# Altium schematic sheet WL-FRONT.SchDoc
size 420 x 297 mm; Address1: Address1; Address2: Address2; Address3: Address3; Address4: Address4; DocumentNumber: АБВГ.123456.001 Э3; SheetNumber: 1; Scale: 1:1; DocumentType: Схема электрическая принципиальная; FirstReferrence: АБВГ.123456.001
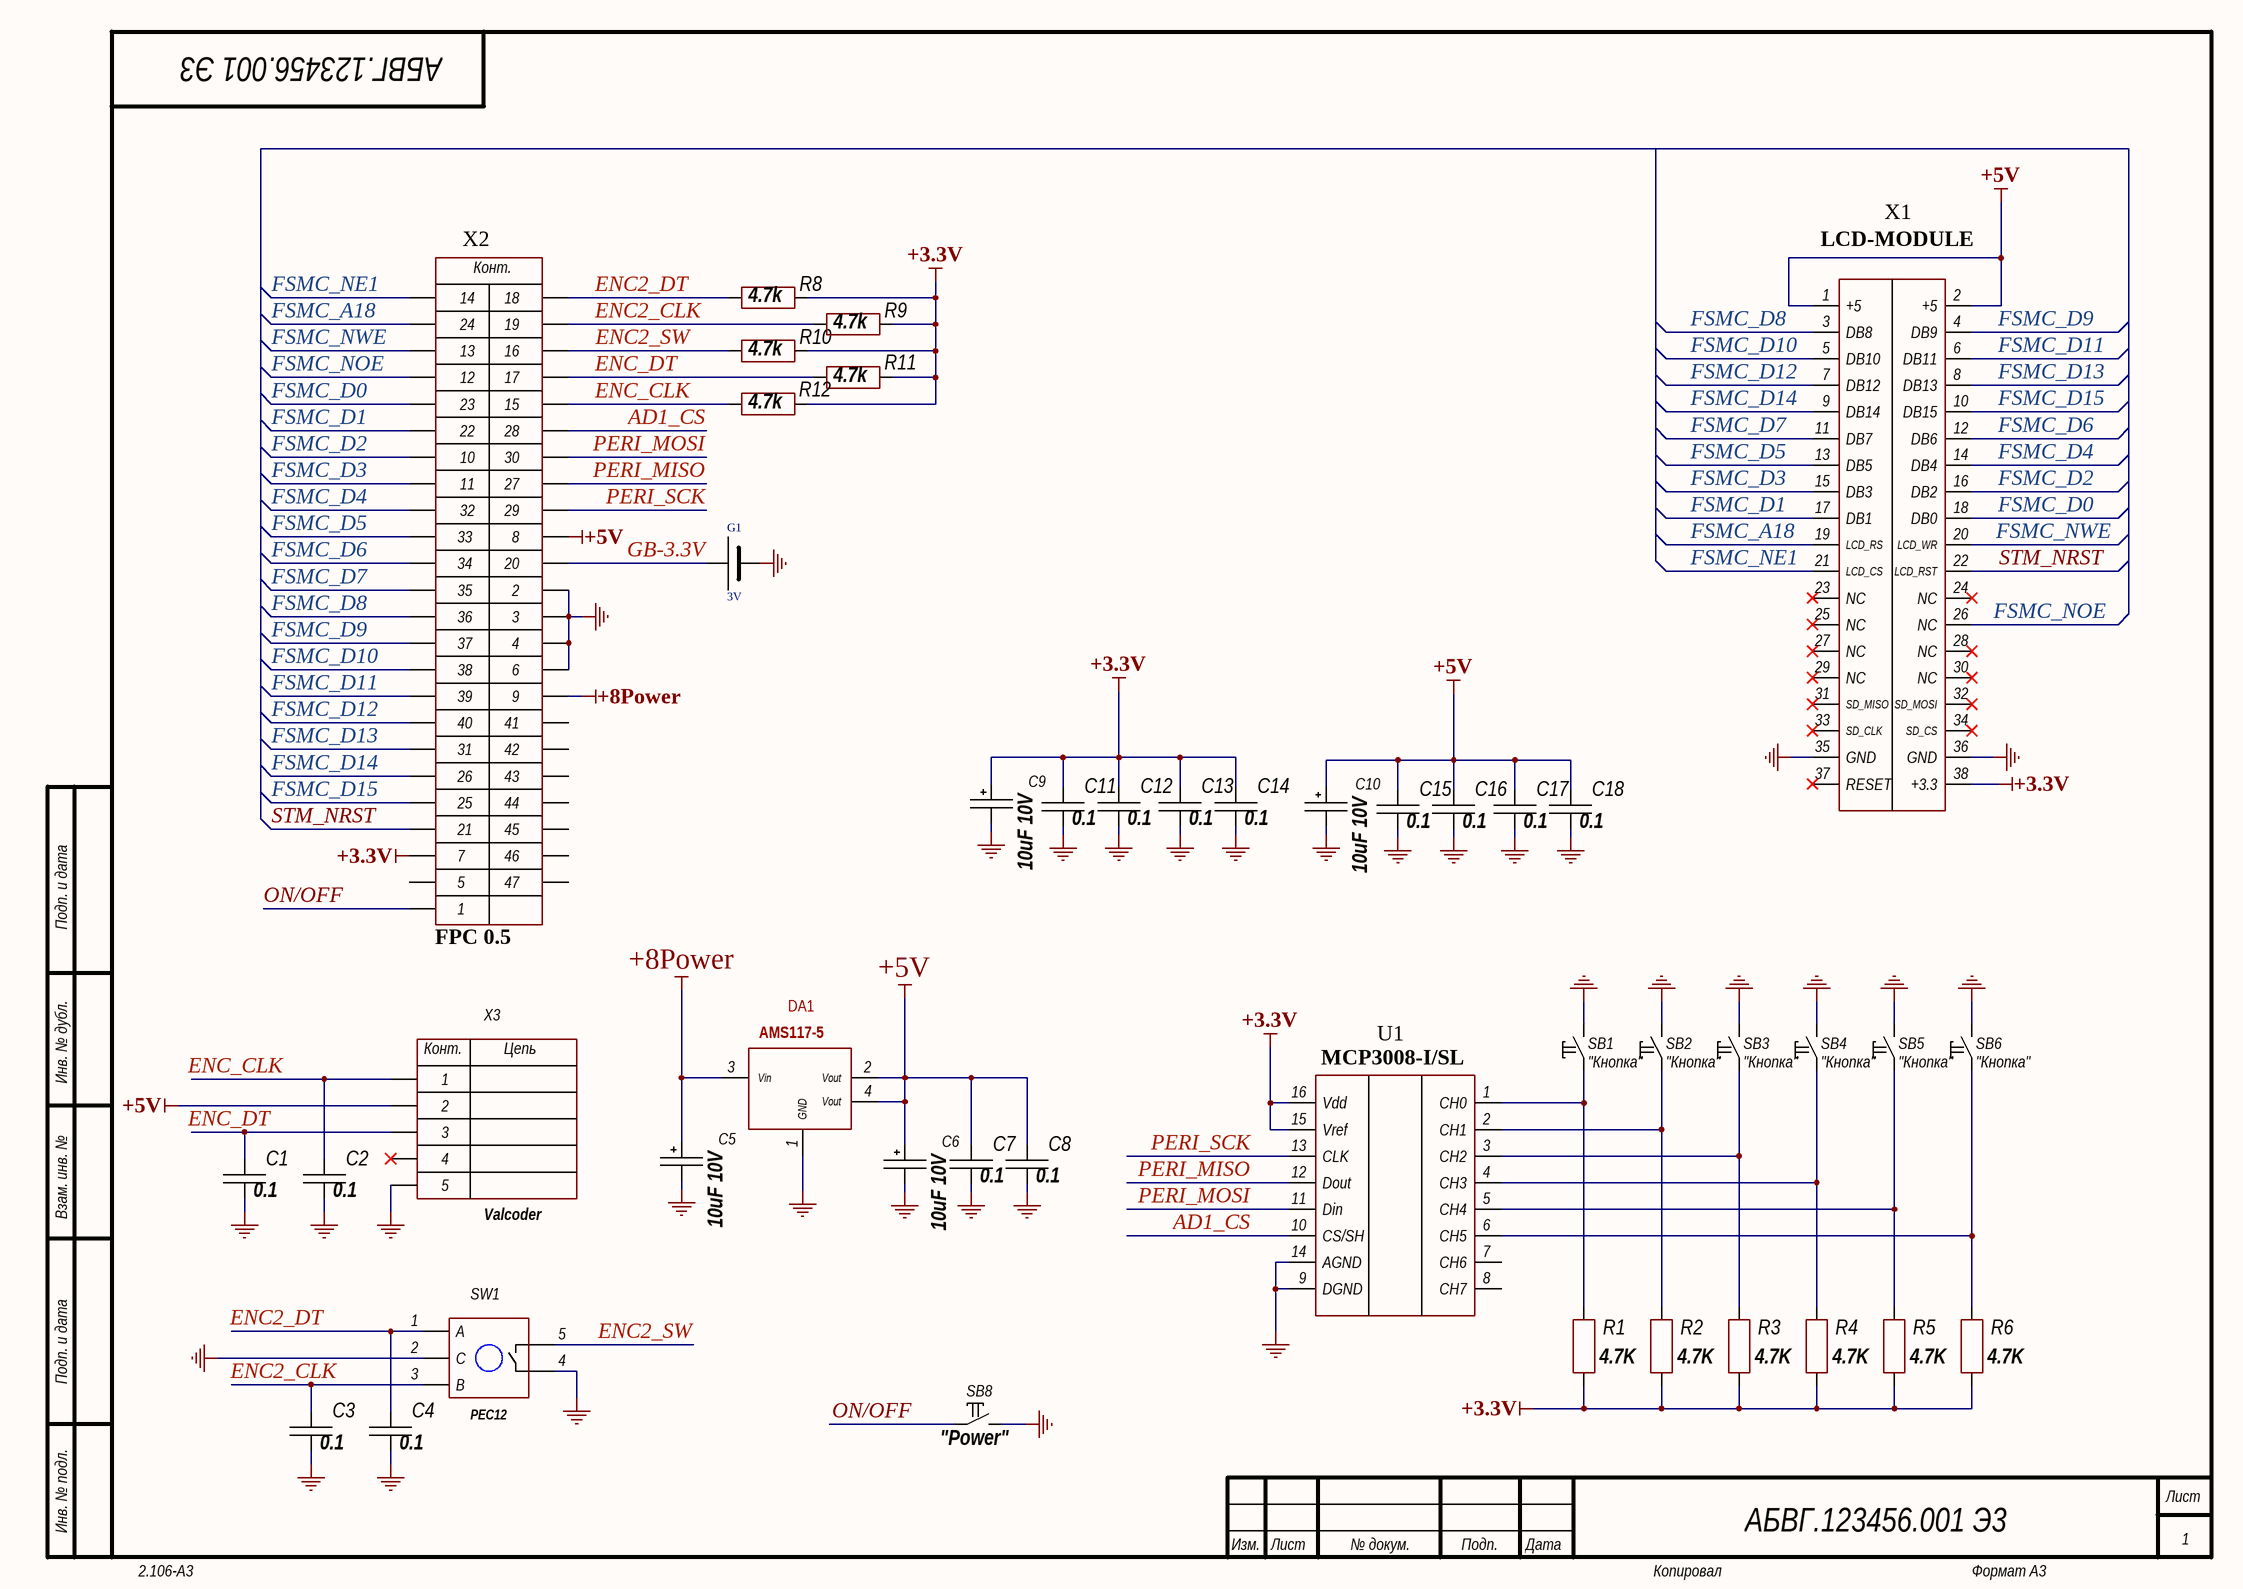
[diagram p0: WL-FRONT.SchDoc]

## Parts
C1  0.1  [CH0805C]
C2  0.1  [CH0805C]
C3  0.1  [CH0805C]
C4  0.1  [CH0805C]
C5  10uF 10V  [TANTAL_B]
C6  10uF 10V  [TANTAL_B]
C7  0.1  [CH0805C]
C8  0.1  [CH0805C]
C9  10uF 10V  [TANTAL_B]
C10  10uF 10V  [TANTAL_B]
C11  0.1  [CH0805C]
C12  0.1  [CH0805C]
C13  0.1  [CH0805C]
C14  0.1  [CH0805C]
C15  0.1  [CH0805C]
C16  0.1  [CH0805C]
C17  0.1  [CH0805C]
C18  0.1  [CH0805C]
DA1  AMS117-5  [SOT223]
G1  3V  [BAT: CH224-2032]
R1  4.7K  [CH0805R]
R2  4.7K  [CH0805R]
R3  4.7K  [CH0805R]
R4  4.7K  [CH0805R]
R5  4.7K  [CH0805R]
R6  4.7K  [CH0805R]
R8  4.7k  [CH0805R]
R9  4.7k  [CH0805R]
R10  4.7k  [CH0805R]
R11  4.7k  [CH0805R]
R12  4.7k  [CH0805R]
SB1  "Кнопка"  [BUT: 6x6 SMD]
SB2  "Кнопка"  [BUT: 6x6 SMD]
SB3  "Кнопка"  [BUT: 6x6 SMD]
SB4  "Кнопка"  [BUT: 6x6 SMD]
SB5  "Кнопка"  [BUT: 6x6 SMD]
SB6  "Кнопка"  [BUT: 6x6 SMD]
SB8  "Power"  [BUT: 6x6]
SW1  PEC12  [Valkoder-m2]
U1  MCP3008-I/SL  [16-SOIC]
X1  LCD-MODULE  [TFT3.2-320x480-pin]
X2  FPC 0.5  [CON: PBD2x20]
X3  Valcoder  [CON: PLS-5]

## Nets
+3.3V: C9.1 C11.1 C12.1 C13.1 C14.1 R1.1 R2.1 R3.1 R4.1 R5.1 R6.1 R8.1 R9.1 R10.1 R11.1 R12.1 U1.15(Vref) U1.16(Vdd) X1.38(+3.3) X2.7
+5V: C6.1 C7.1 C8.1 C10.1 C15.1 C16.1 C17.1 C18.1 DA1.2(Vout) DA1.4(Vout) X1.1(+5) X1.2(+5) X2.8 X3.2
+8Power: C5.1 DA1.3(Vin) X2.9
GND: C1.2 C2.2 C3.2 C4.2 C5.2 C6.2 C7.2 C8.2 C9.2 C10.2 C11.2 C12.2 C13.2 C14.2 C15.2 C16.2 C17.2 C18.2 DA1.1(GND) G1.2 SB1.2 SB2.2 SB3.2 SB4.2 SB5.2 SB6.2 SB8.2 SW1.2(C) SW1.4 U1.9(DGND) U1.14(AGND) X1.35(GND) X1.36(GND) X2.2 X2.3 X2.4 X2.6 X3.5
AD1_CS: U1.10(CS/SH) X2.28
ENC2_CLK: C3.1 R9.2 SW1.3(B) X2.19
ENC2_DT: C4.1 R8.2 SW1.1(A) X2.18
ENC2_SW: R10.2 SW1.5 X2.16
ENC_CLK: C2.1 R12.2 X2.15 X3.1
ENC_DT: C1.1 R11.2 X2.17 X3.3
FSMC_A18: X1.19(LCD_RS) X2.24
FSMC_D0: X1.18(DB0) X2.23
FSMC_D1: X1.17(DB1) X2.22
FSMC_D2: X1.16(DB2) X2.10
FSMC_D3: X1.15(DB3) X2.11
FSMC_D4: X1.14(DB4) X2.32
FSMC_D5: X1.13(DB5) X2.33
FSMC_D6: X1.12(DB6) X2.34
FSMC_D7: X1.11(DB7) X2.35
FSMC_D8: X1.3(DB8) X2.36
FSMC_D9: X1.4(DB9) X2.37
FSMC_D10: X1.5(DB10) X2.38
FSMC_D11: X1.6(DB11) X2.39
FSMC_D12: X1.7(DB12) X2.40
FSMC_D13: X1.8(DB13) X2.31
FSMC_D14: X1.9(DB14) X2.26
FSMC_D15: X1.10(DB15) X2.25
FSMC_NE1: X1.21(LCD_CS) X2.14
FSMC_NOE: X1.26(NC) X2.12
FSMC_NWE: X1.20(LCD_WR) X2.13
GB-3.3V: G1.1 X2.20
ON/OFF: SB8.1 X2.1
PERI_MISO: U1.12(Dout) X2.27
PERI_MOSI: U1.11(Din) X2.30
PERI_SCK: U1.13(CLK) X2.29
STM_NRST: X1.22(LCD_RST) X2.21
NetR1_2: R1.2 SB1.1 U1.1(CH0)
NetR2_2: R2.2 SB2.1 U1.2(CH1)
NetR3_2: R3.2 SB3.1 U1.3(CH2)
NetR4_2: R4.2 SB4.1 U1.4(CH3)
NetR5_2: R5.2 SB5.1 U1.5(CH4)
NetR6_2: R6.2 SB6.1 U1.6(CH5)

Not connected (* = marked no-connect by the designer): U1 7(CH6) 8(CH7); X1 23(NC)* 24(NC)* 25(NC)* 27(NC)* 28(NC)* 29(NC)* 30(NC)* 31(SD_MISO)* 32(SD_MOSI)* 33(SD_CLK)* 34(SD_CS)* 37(RESET)*; X2 5 41 42 43 44 45 46 47; X3 4*

## Notes on the sheet
- Подп. и дата
- Инв. № дубл.
- Взам. инв. №
- Инв. № подл.
- Изм.
- Лист
- № докум.
- Подп.
- Дата
- 2.106-A3
- Копировал
- Формат А3
- (in symbol 5-Connector) Конт.; Цепь
- (in symbol FPC-45-0.5) Конт.

## Library data of the parts
C1-C4 C7 C8 C11-C18 = Capacitor: Manufacturer: *; Model: *; HelpURL: *; ComponentKind: *; Value: *
C5 C6 C9 C10 = TantalCap: Manufacturer: *; Model: *; HelpURL: *; ComponentKind: *; Value: *
DA1 = AMS117
G1 = POWER_BAT
R1-R6 R8-R12 = Resistor: Manufacturer: *; Model: *; HelpURL: *; ComponentKind: *; Value: *
SB1-SB6 SB8 = Tactile switches: 6x6 mm; Manufacturer: *; Model: *; HelpURL: *; ComponentKind: *
SW1 = PEC12: Encoder; Model: *; Manufacturer: *; HelpURL: *; ComponentKind: *
X2 = FPC-45-0.5: System: Connector
X3 = 5-Connector: Model: *; Manufacturer: *; HelpURL: *; ComponentKind: *